# Altium schematic sheet main.SchDoc
size A4; SheetNumber: 1; SheetTotal: 4
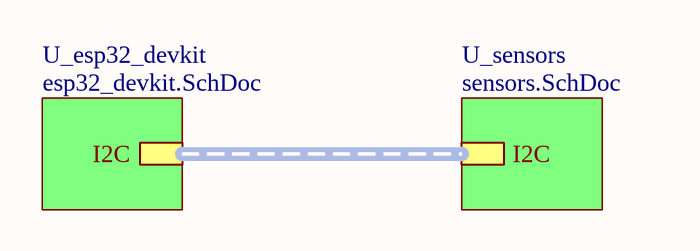
[diagram p0: main.SchDoc]

## Sub-sheets
U_esp32_devkit = esp32_devkit.SchDoc: I2C (harness I2C)
U_sensors = sensors.SchDoc: I2C (harness I2C)

## Buses and harness runs
harness sheet U_esp32_devkit/I2C = sheet U_sensors/I2C